# Altium schematic sheet PCB_Schematic.SchDoc
size A4; SheetNumber: 1; SheetTotal: 1
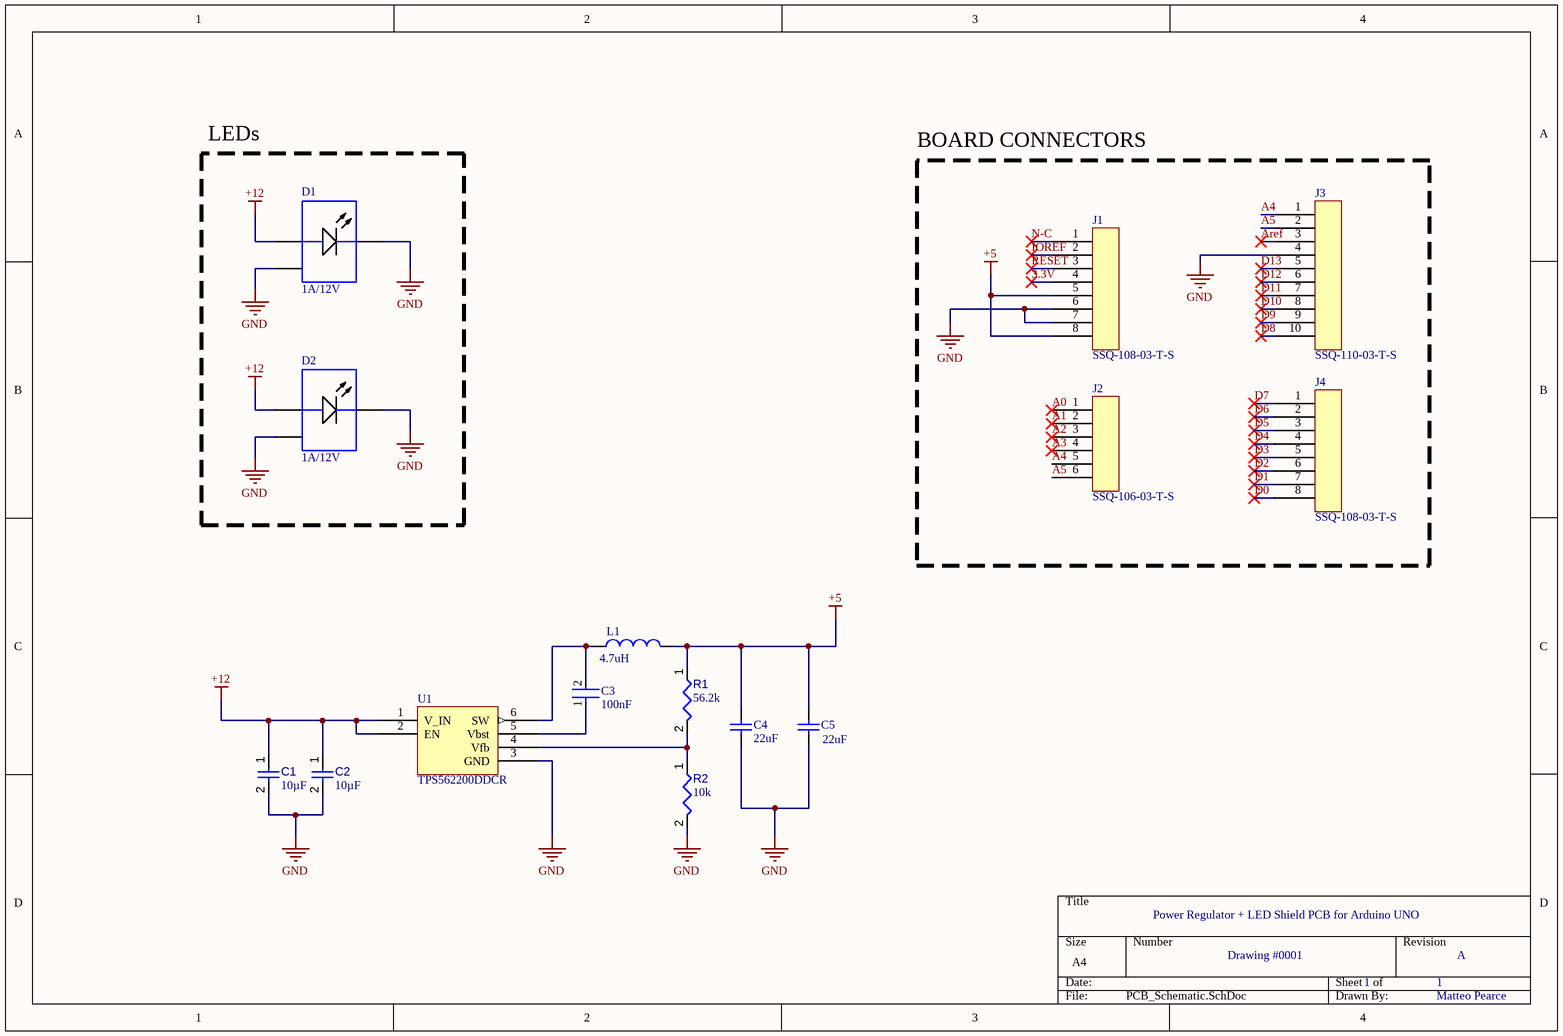
[diagram p0: PCB_Schematic.SchDoc]

## Parts
C1  value 10µF  [CAPC2012X10N]  (hidden comment: C2012X5R1V106K085AC)
C2  value 10µF  [CAPC2012X10N]  (hidden comment: C2012X5R1V106K085AC)
C3  100nF  [FP-CC0805-0_85-MFG]
C4  22uF  [CAPC1608X100X20ML10]
C5  22uF  [CAPC1608X100X20ML10]
D1  1A/12V  [CREE-MK-R-2_V]
D2  1A/12V  [CREE-MK-R-2_V]
J1  SSQ-108-03-T-S  [SSQ-106-03-T-S-Footprint-2]
J2  SSQ-106-03-T-S  [SSQ-106-03-T-S-Footprint-2]
J3  SSQ-110-03-T-S  [SSQ-110-03-T-S-Footprint-2]
J4  SSQ-108-03-T-S  [SSQ-106-03-T-S-Footprint-2]
L1  4.7uH  [INDP6060X45N]
R1  value 56.2k  [RESC0603X03N]  (hidden comment: RC0201FR-0756K2L)
R2  value 10k  [CAPC0603X03N]  (hidden comment: RC0201FR-0710KL)
U1  TPS562200DDCR  [SOT95P280X110-6N]

## Blocks framed on the sheet
LEDs: D1 D2
BOARD CONNECTORS: J1-J4

## Nets
+5: C4.1 C5.1 J1.5 J1.8 L1.2 R1.1
+12: C1.1 C2.1 D1.1(A) D2.1(A) U1.1(V_IN) U1.2(EN)
GND: C1.2 C2.2 C4.2 C5.2 D1.2(K) D1.3(EP) D2.2(K) D2.3(EP) J1.6 J1.7 J3.4 R2.2 U1.3(GND)
3.3V: J1.4
A0: J2.1
A1: J2.2
A2: J2.3
A3: J2.4
A4: J2.5 J3.1
A5: J2.6 J3.2
Aref: J3.3
D0: J4.8
D1: J4.7
D2: J4.6
D3: J4.5
D4: J4.4
D5: J4.3
D6: J4.2
D7: J4.1
D8: J3.10
D9: J3.9
D10: J3.8
D11: J3.7
D12: J3.6
D13: J3.5
IOREF: J1.2
N-C: J1.1
RESET: J1.3
NetC3_1: C3.1 U1.5(Vbst)
NetC3_2: C3.2 L1.1 U1.6(SW)
NetR1_2: R1.2 R2.1 U1.4(Vfb)

## Notes on the sheet
- Power Regulator + LED Shield PCB for Arduino UNO
- Drawing #0001
- 1
- A
- Matteo Pearce

## Library data of the parts
C1 C2 = CMP-001-00083-1: Ceramic Capacitor, Multilayer, Ceramic, 35V, 10% +Tol, 10% -Tol, X5R, 15% TC, 10uF, Surface Mount, 0805; Mounting Technology: Surface Mount; Min Operating Temperature: -55°C; Pins: 2; Case/Package: 0805; Capacitor Type: Ceramic; Max Operating Temperature: 85°C; RoHS Compliant: Yes
C3 = CMP-1036-04410-2: CAP CER 0.1UF 25V X7R 0805; Manufacturer Part Number: CC0805KRX7R8BB104; Manufacturer: Yageo; Tolerance: 0.1; Material: Ceramic; ComponentLink2URL: http://www.yageo.com/documents/recent/UPY-GPHC_Y5V_6.3V-to-50V_8.pdf; Category: Cap; Mouser Description: Multilayer Ceramic Capacitors MLCC - SMD/SMT 100nF 25V X7R 10%; Device Class L1: Passive Components; Footprint Url: http://www.yageo.com/exep/pages/download/literatures/UPY-C_GEN_24.pdf; Height: 0.95mm; Digikey Description: CAP CER 0.1UF 25V X7R 0805; Lead Free: Yes; Temperature Range High: +85°C; Temperature: -30°C to +85°C; Ipc Land Pattern Name: CAPC200125X85; Value: 100 nF; Capacitance: 100 nF; Automotive: No; Octopart: https://octopart.com/cc0805krx7r8bb104-yageo-39467766; Device Class L2: Capacitors; Temperature Characteristic: X7R; Voltage Rating: 25 V; ComponentLink2Description: Datasheet; Temperature Range Low: -30°C; Device Class L3: Ceramic Capacitors; RoHS: TRUE; Package: CC0805-0.85
C4 C5 = CMP-2000-05441-1: Chip Capacitor, 22 uF, +/- 20%, 10 V, -55 to 85 degC, 0603 (1608 Metric), RoHS, Tape and Reel; Manufacturer: TDK; PCN Part Number: MLCCPartNumberChange30/Nov/2012; Voltage - Rated: 10V; Product Training Modules: CSeriesGeneralApplicationsSEAT,CCV,andTVCLDesignToolsGuidetoReplacinganElectrolyticCapacitorwithanMLCC; Other Names: 445-9077-1; Design Resources: 20WNon-IsolatedBuckLEDDriverUsingPLLNK460KG; Online Catalog: CSeries,GeneralPurpose; Capacitance: 22µF; Temperature Coefficient: X5R; Kits: 445-9014-KIT-ND-KITMLCC100PF-22UF060310-50V; Packaging: CutTape(CT); Standard Package: 1; Package / Case: 0603(1608Metric); Lead Style: -; Features: -; Ratings: -; Operating Temperature: -55degC~85degC; Applications: GeneralPurpose; Package Reference: 603; Datasheet URL: http://download.siliconexpert.com/pdfs/2015/4/21/15/54/45/779/tdk_/manual/37024850441143360mlcc_commercial_general_en.pdf; Datasheet Version: Mar-15; Mounting Type: SurfaceMount,MLCC; Lead Spacing: -; Size / Dimension: 0.063"Lx0.031"W(1.60mmx0.80mm); Height - Seated (Max): -; Package Description: 2-Pin Surface Mount Device, Body 1.6 x 0.8 mm; Manufacturer URL: http://www.tdk.com/; RoHS Information: RoHSCertificate-MLCC; Tolerance: ±20%; Series: C; Thickness (Max): 0.035"(0.90mm); Family: CeramicCapacitors; Category: Capacitors
D1 D2 = CMP-2100-00977-1: LED, White, 12 V, 2-Pin SMD, RoHS, Tape and Reel
J1 J4 = CMP-002-00072-1: Board Connector, 8 Contact(s), 1 Row(s), Female, Straight, 0.1 inch Pitch, Solder Terminal, Black Insulator, Socket; Additional Feature: TIGER BUY CONTACT; Body Depth: 0.335inch; Body Breadth: 0.095inch; RoHS Compliant: Yes; Mounting Technology: Board; Body/Shell Style: SOCKET; Connector Type: BOARD CONNECTOR; Max Operating Temperature: 105°C; Min Operating Temperature: -65°C
J2 = CMP-002-00071-2: Board Connector, 6 Contact(s), 1 Row(s), Female, Straight, 0.1 inch Pitch, Solder Terminal, Locking, Black Insulator, Socket; Body Breadth: 0.095inch; Body Length: 0.62inch; Body Depth: 0.335inch; Additional Feature: TIGER BUY CONTACT; Min Operating Temperature: -65°C; Max Operating Temperature: 105°C; Pins: 6; RoHS Compliant: Yes; Mounting Technology: Board; Connector Type: BOARD CONNECTOR
J3 = CMP-002-00073-1: Board Connector, 10 Contact(s), 1 Row(s), Female, Straight, 0.1 inch Pitch, Solder Terminal, Black Insulator, Socket; MIL Conformance: No; PCB Contact Pattern: RECTANGULAR; Number Of PCB Rows: 1; Reference Standard: UL; Reliability: COMMERCIAL; Number of Contacts: 10; Contact Style: SQ PIN-SKT; Additional Feature: TIGER BUY CONTACT; Body Breadth: 0.095inch; Mating Information: MULTIPLE MATING PARTS AVAILABLE; Plating Thickness: 200uin; Option: General Purpose; Body Depth: 0.335inch; Contact Resistance: 10mR; JESD-609 Code: e3; Contact Material: Bronze; Mating Contact Pitch: 0.1inch; Number of Rows Loaded: 1; Insulation Color: Black; Mixed Contacts: No; Body/Shell Style: SOCKET; Mounting Style: STRAIGHT; Contact Finish - Termination: Tin (Sn) - with Nickel (Ni) barrier; Reach SVHC Compliant: Yes; Contact Gender: Female; Terminal Pitch: 2.54mm; Mounting Technology: Board; RoHS Compliant: Yes; Insulation Material: Polymer; Connector Type: BOARD CONNECTOR; IEC Conformance: No; Contact Pattern: RECTANGULAR; Contact Finish - Mating: MATTE TIN OVER NICKEL (50); Min Operating Temperature: -65°C; Termination: Solder; DIN Conformance: No; Number Of Connectors: 1; Max Operating Temperature: 105°C; Filter Feature: No
L1 = CMP-006-00021-1: General Purpose Inductor, 4.7uH, 30%, 1 Element, Ferrite-Core, SMD, 2424; Max Current Rating: 3A; Pins: 2; Tolerance: 30%; Max Operating Temperature: 125°C; Min Operating Temperature: -40°C; RoHS Compliant: Yes
R1 = CMP-009-00178-2: Fixed Resistor, Metal Glaze/thick Film, 0.05W, 56200ohm, 25V, 1% +/-Tol, 200ppm/Cel, Surface Mount, 0201; Package Length: 0.6mm; Power: 50mW; Rated Temperature: 70°C; Temperature Coefficient: 200ppm/°C; Package Height: 0.23mm; Package Width: 0.3mm; Additional Feature: LASER TRIMMABLE; Termination: Wraparound; Tolerance: 1%; Case/Package: 0201; Working Voltage: 25V; Reach SVHC Compliant: Yes; Construction: Chip; Packaging: Tape and Reel; Technology: METAL GLAZE/THICK FILM; JESD-609 Code: e3; Package Style: SMTMeter; Max Operating Temperature: 125°C; Pins: 2; Terminal Finish: Nickel; RoHS Compliant: Yes; Resistor Type: FIXED RESISTOR; Min Operating Temperature: -55°C; Package Shape: Rectangular; Mounting Technology: Surface Mount
R2 = CMP-009-00177-1: Fixed Resistor, Metal Glaze/thick Film, 0.05W, 10000ohm, 25V, 1% +/-Tol, 200ppm/Cel, Surface Mount, 0201; Power: 50mW; Pins: 2; Case/Package: 0201; Max Operating Temperature: 125°C; RoHS Compliant: Yes; Min Operating Temperature: -55°C; Mounting Technology: Surface Mount; Tolerance: 1%
U1 = CMP-00024-00006-1: Switching Regulator, 2A, 650kHz Switching Freq-Max, PDSO6; Nominal Supply Voltage: 12V; RoHS Compliant: Yes; Case/Package: TSSOP; Min Operating Temperature: -40°C; Pins: 6; Max Operating Temperature: 85°C